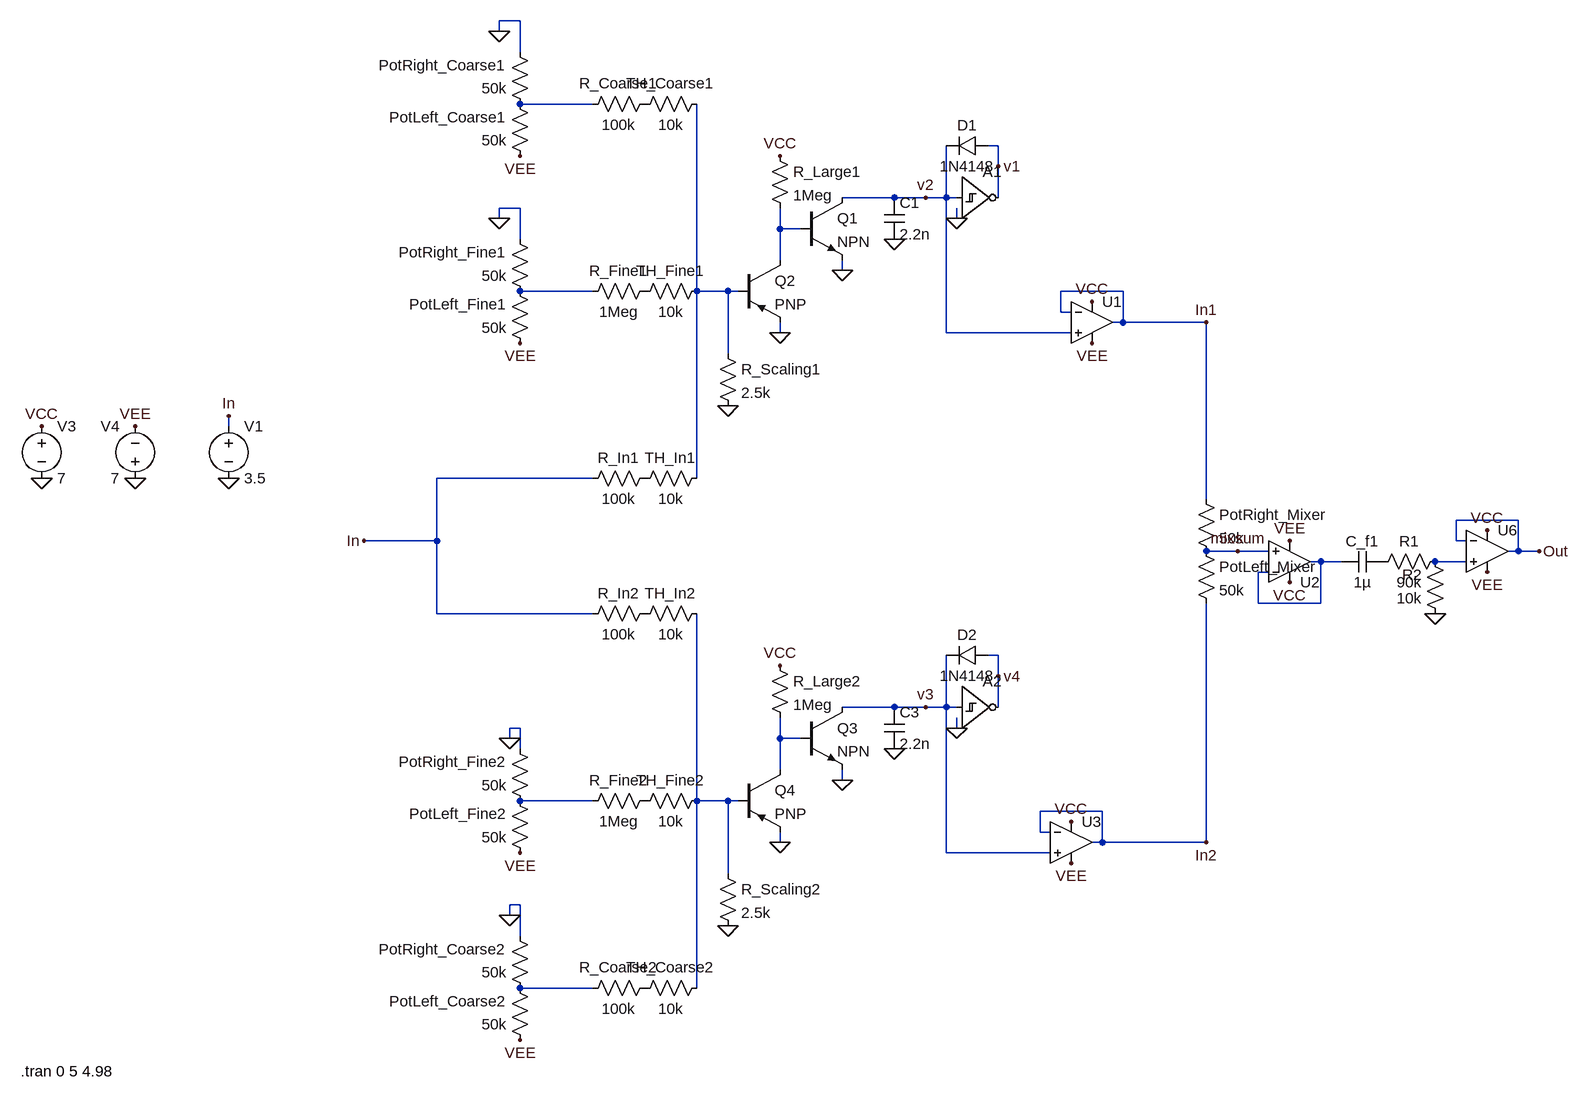
[diagram p0: schematic Oscillator.asc]
Oscillator.asc, the LTspice schematic file:
Version 4.1
SHEET 1 1464 1484
WIRE -544 -176 -576 -176
WIRE -576 -160 -576 -176
WIRE -544 -128 -544 -176
WIRE -432 -48 -544 -48
WIRE 192 16 176 16
WIRE 192 48 192 16
WIRE 32 96 -48 96
WIRE 80 96 32 96
WIRE 112 96 112 16
WIRE 112 96 80 96
WIRE 128 96 112 96
WIRE 192 96 192 48
WIRE -544 112 -576 112
WIRE -576 128 -576 112
WIRE 128 128 128 112
WIRE -144 144 -144 112
WIRE -112 144 -144 144
WIRE -544 160 -544 112
WIRE -144 192 -144 144
WIRE -48 208 -48 192
WIRE -432 240 -544 240
WIRE -272 240 -272 -48
WIRE -224 240 -272 240
WIRE -208 240 -224 240
WIRE 384 240 288 240
WIRE 288 272 288 240
WIRE 304 272 288 272
WIRE 384 288 384 240
WIRE 384 288 368 288
WIRE 512 288 384 288
WIRE -144 304 -144 288
WIRE 112 304 112 96
WIRE 304 304 112 304
WIRE -224 336 -224 240
WIRE -992 448 -992 432
WIRE -432 528 -672 528
WIRE -272 528 -272 240
WIRE 512 560 512 288
WIRE 992 592 896 592
WIRE -672 624 -672 528
WIRE -672 624 -784 624
WIRE 896 624 896 592
WIRE 912 624 896 624
WIRE 560 640 512 640
WIRE 608 640 560 640
WIRE 992 640 992 592
WIRE 992 640 976 640
WIRE 1024 640 992 640
WIRE 688 656 672 656
WIRE 720 656 688 656
WIRE 912 656 864 656
WIRE 608 672 592 672
WIRE 592 720 592 672
WIRE 688 720 688 656
WIRE 688 720 592 720
WIRE -672 736 -672 624
WIRE -432 736 -672 736
WIRE 192 800 176 800
WIRE 192 832 192 800
WIRE 32 880 -48 880
WIRE 80 880 32 880
WIRE 112 880 112 800
WIRE 112 880 80 880
WIRE 128 880 112 880
WIRE 192 880 192 832
WIRE -544 912 -560 912
WIRE 128 912 128 896
WIRE -560 928 -560 912
WIRE -144 928 -144 896
WIRE -112 928 -144 928
WIRE -544 944 -544 912
WIRE -144 976 -144 928
WIRE -48 992 -48 976
WIRE -432 1024 -544 1024
WIRE -272 1024 -272 736
WIRE -224 1024 -272 1024
WIRE -208 1024 -224 1024
WIRE 352 1040 256 1040
WIRE 256 1072 256 1040
WIRE 272 1072 256 1072
WIRE -144 1088 -144 1072
WIRE 352 1088 352 1040
WIRE 352 1088 336 1088
WIRE 512 1088 512 720
WIRE 512 1088 352 1088
WIRE 112 1104 112 880
WIRE 272 1104 112 1104
WIRE -224 1136 -224 1024
WIRE -544 1184 -560 1184
WIRE -560 1200 -560 1184
WIRE -544 1232 -544 1184
WIRE -432 1312 -544 1312
WIRE -272 1312 -272 1024
FLAG -48 208 0
FLAG 192 48 v1
FLAG 80 96 v2
FLAG 1024 640 Out
FLAG 128 128 0
FLAG 32 160 0
FLAG -144 304 0
FLAG -48 992 0
FLAG 192 832 v4
FLAG 80 880 v3
FLAG 128 912 0
FLAG 32 944 0
FLAG -144 1088 0
FLAG 512 288 In1
FLAG 512 1088 In2
FLAG 560 640 mixsum
FLAG 864 736 0
FLAG -224 1216 0
FLAG -224 416 0
FLAG -1280 528 0
FLAG -1136 528 0
FLAG -1280 448 VCC
FLAG -1136 448 VEE
FLAG -784 624 In
FLAG -544 320 VEE
FLAG -544 32 VEE
FLAG -576 -160 0
FLAG -576 128 0
FLAG -560 928 0
FLAG -560 1200 0
FLAG -544 1104 VEE
FLAG -544 1392 VEE
FLAG -144 32 VCC
FLAG -144 816 VCC
FLAG 336 256 VCC
FLAG 336 320 VEE
FLAG 304 1056 VCC
FLAG 304 1120 VEE
FLAG 944 608 VCC
FLAG 944 672 VEE
FLAG -992 528 0
FLAG -992 432 In
FLAG 640 624 VEE
FLAG 640 688 VCC
SYMBOL Digital\\schmtinv 128 32 R0
WINDOW 3 8 44 Invisible 2
SYMATTR Value Vhigh=9 Vt=4.45 Vh=.85 Trise=.1u Tfall=.1u
SYMATTR InstName A1
SYMBOL cap 16 96 R0
SYMATTR InstName C1
SYMATTR Value 2.2n
SYMBOL diode 176 0 R90
WINDOW 0 0 32 VBottom 2
WINDOW 3 32 32 VTop 2
SYMATTR InstName D1
SYMATTR Value 1N4148
SYMBOL npn -112 96 R0
SYMATTR InstName Q1
SYMBOL res -160 16 R0
SYMATTR InstName R_Large1
SYMATTR Value 1Meg
SYMBOL pnp -208 192 R0
SYMATTR InstName Q2
SYMBOL res -256 224 R90
WINDOW 0 0 56 VBottom 2
WINDOW 3 32 56 VTop 2
SYMATTR InstName TH_Fine1
SYMATTR Value 10k
SYMBOL res -256 -64 R90
WINDOW 0 0 56 VBottom 2
WINDOW 3 32 56 VTop 2
SYMATTR InstName TH_Coarse1
SYMATTR Value 10k
SYMBOL res -336 -64 R90
WINDOW 0 0 56 VBottom 2
WINDOW 3 32 56 VTop 2
SYMATTR InstName R_Coarse1
SYMATTR Value 100k
SYMBOL res -336 224 R90
WINDOW 0 0 56 VBottom 2
WINDOW 3 32 56 VTop 2
SYMATTR InstName R_Fine1
SYMATTR Value 1Meg
SYMBOL res -528 -32 R180
WINDOW 0 36 76 Left 2
WINDOW 3 36 40 Left 2
SYMATTR InstName PotRight_Coarse1
SYMATTR Value 50k
SYMBOL res -528 48 R180
WINDOW 0 36 76 Left 2
WINDOW 3 36 40 Left 2
SYMATTR InstName PotLeft_Coarse1
SYMATTR Value 50k
SYMBOL res -528 256 R180
WINDOW 0 36 76 Left 2
WINDOW 3 36 40 Left 2
SYMATTR InstName PotRight_Fine1
SYMATTR Value 50k
SYMBOL res -528 336 R180
WINDOW 0 36 76 Left 2
WINDOW 3 36 40 Left 2
SYMATTR InstName PotLeft_Fine1
SYMATTR Value 50k
SYMBOL res -256 512 R90
WINDOW 0 0 56 VBottom 2
WINDOW 3 32 56 VTop 2
SYMATTR InstName TH_In1
SYMATTR Value 10k
SYMBOL res -336 512 R90
WINDOW 0 0 56 VBottom 2
WINDOW 3 32 56 VTop 2
SYMATTR InstName R_In1
SYMATTR Value 100k
SYMBOL Digital\\schmtinv 128 816 R0
WINDOW 3 8 44 Invisible 2
SYMATTR Value Vhigh=9 Vt=4.45 Vh=.85 Trise=.1u Tfall=.1u
SYMATTR InstName A2
SYMBOL cap 16 880 R0
SYMATTR InstName C3
SYMATTR Value 2.2n
SYMBOL diode 176 784 R90
WINDOW 0 0 32 VBottom 2
WINDOW 3 32 32 VTop 2
SYMATTR InstName D2
SYMATTR Value 1N4148
SYMBOL npn -112 880 R0
SYMATTR InstName Q3
SYMBOL res -160 800 R0
SYMATTR InstName R_Large2
SYMATTR Value 1Meg
SYMBOL pnp -208 976 R0
SYMATTR InstName Q4
SYMBOL res -256 1008 R90
WINDOW 0 0 56 VBottom 2
WINDOW 3 32 56 VTop 2
SYMATTR InstName TH_Fine2
SYMATTR Value 10k
SYMBOL res -256 1296 R90
WINDOW 0 0 56 VBottom 2
WINDOW 3 32 56 VTop 2
SYMATTR InstName TH_Coarse2
SYMATTR Value 10k
SYMBOL res -336 1296 R90
WINDOW 0 0 56 VBottom 2
WINDOW 3 32 56 VTop 2
SYMATTR InstName R_Coarse2
SYMATTR Value 100k
SYMBOL res -336 1008 R90
WINDOW 0 0 56 VBottom 2
WINDOW 3 32 56 VTop 2
SYMATTR InstName R_Fine2
SYMATTR Value 1Meg
SYMBOL res -528 1328 R180
WINDOW 0 36 76 Left 2
WINDOW 3 36 40 Left 2
SYMATTR InstName PotRight_Coarse2
SYMATTR Value 50k
SYMBOL res -528 1408 R180
WINDOW 0 36 76 Left 2
WINDOW 3 36 40 Left 2
SYMATTR InstName PotLeft_Coarse2
SYMATTR Value 50k
SYMBOL res -528 1040 R180
WINDOW 0 36 76 Left 2
WINDOW 3 36 40 Left 2
SYMATTR InstName PotRight_Fine2
SYMATTR Value 50k
SYMBOL res -528 1120 R180
WINDOW 0 36 76 Left 2
WINDOW 3 36 40 Left 2
SYMATTR InstName PotLeft_Fine2
SYMATTR Value 50k
SYMBOL res -256 720 R90
WINDOW 0 0 56 VBottom 2
WINDOW 3 32 56 VTop 2
SYMATTR InstName TH_In2
SYMATTR Value 10k
SYMBOL res -336 720 R90
WINDOW 0 0 56 VBottom 2
WINDOW 3 32 56 VTop 2
SYMATTR InstName R_In2
SYMATTR Value 100k
SYMBOL res 496 544 R0
SYMATTR InstName PotRight_Mixer
SYMATTR Value 50k
SYMBOL res 496 624 R0
SYMATTR InstName PotLeft_Mixer
SYMATTR Value 50k
SYMBOL OpAmps\\UniversalOpAmp2 336 288 R0
SYMATTR InstName U1
SYMBOL OpAmps\\UniversalOpAmp2 304 1088 R0
SYMATTR InstName U3
SYMBOL cap 784 640 R90
WINDOW 0 0 32 VBottom 2
WINDOW 3 32 32 VTop 2
SYMATTR InstName C_f1
SYMATTR Value 1µ
SYMBOL res 880 752 R180
WINDOW 0 36 76 Left 2
WINDOW 3 36 40 Left 2
SYMATTR InstName R2
SYMATTR Value 10k
SYMBOL OpAmps\\UniversalOpAmp2 944 640 R0
SYMATTR InstName U6
SYMBOL res -240 1120 R0
SYMATTR InstName R_Scaling2
SYMATTR Value 2.5k
SYMBOL res -240 320 R0
SYMATTR InstName R_Scaling1
SYMATTR Value 2.5k
SYMBOL voltage -1280 432 R0
WINDOW 123 0 0 Left 0
WINDOW 39 0 0 Left 0
SYMATTR InstName V3
SYMATTR Value 7
SYMBOL voltage -1136 544 R180
WINDOW 0 24 96 Left 2
WINDOW 3 24 16 Left 2
WINDOW 123 0 0 Left 0
WINDOW 39 0 0 Left 0
SYMATTR InstName V4
SYMATTR Value 7
SYMBOL voltage -992 432 R0
WINDOW 123 0 0 Left 0
WINDOW 39 0 0 Left 0
SYMATTR InstName V1
SYMATTR Value 3.5
SYMBOL OpAmps\\UniversalOpAmp2 640 656 M180
SYMATTR InstName U2
SYMBOL res 880 640 R90
WINDOW 0 0 56 VBottom 2
WINDOW 3 32 56 VTop 2
SYMATTR InstName R1
SYMATTR Value 90k
TEXT -1312 1440 Left 2 !.tran 0 5 4.98

The netlist it stands for:
* Oscillator.asc
A1 v2 0 0 0 0 v1 0 0 SCHMITT Vhigh=9 Vt=4.45 Vh=.85 Trise=.1u Tfall=.1u
C1 v2 0 2.2n
D1 v1 v2 1N4148
Q1 v2 N002 0 0 NPN
R_Large1 VCC N002 1Meg
Q2 N002 N004 0 0 PNP
R§TH_Fine1 N004 P001 10k
R§TH_Coarse1 N004 P002 10k
R_Coarse1 P002 N001 100k
R_Fine1 P001 N003 1Meg
R§PotRight_Coarse1 N001 0 50k
R§PotLeft_Coarse1 VEE N001 50k
R§PotRight_Fine1 N003 0 50k
R§PotLeft_Fine1 VEE N003 50k
R§TH_In1 N004 P003 10k
R_In1 P003 In 100k
A2 v3 0 0 0 0 v4 0 0 SCHMITT Vhigh=9 Vt=4.45 Vh=.85 Trise=.1u Tfall=.1u
C3 v3 0 2.2n
D2 v4 v3 1N4148
Q3 v3 N007 0 0 NPN
R_Large2 VCC N007 1Meg
Q4 N007 N009 0 0 PNP
R§TH_Fine2 N009 P004 10k
R§TH_Coarse2 N009 P005 10k
R_Coarse2 P005 N010 100k
R_Fine2 P004 N008 1Meg
R§PotRight_Coarse2 N010 0 50k
R§PotLeft_Coarse2 VEE N010 50k
R§PotRight_Fine2 N008 0 50k
R§PotLeft_Fine2 VEE N008 50k
R§TH_In2 N009 P006 10k
R_In2 P006 In 100k
R§PotRight_Mixer In1 mixsum 50k
R§PotLeft_Mixer mixsum In2 50k
X§U1 v2 In1 VCC VEE In1 level2 Avol=1Meg GBW=10Meg Slew=10Meg Ilimit=25m Rail=0 Vos=0 En=0 Enk=0 In=0 Ink=0 Rin=500Meg  ; pins In+ In- V+ V- OUT
X§U3 v3 In2 VCC VEE In2 level2 Avol=1Meg GBW=10Meg Slew=10Meg Ilimit=25m Rail=0 Vos=0 En=0 Enk=0 In=0 Ink=0 Rin=500Meg  ; pins In+ In- V+ V- OUT
C_f1 P007 N005 1µ
R2 0 N006 10k
X§U6 N006 Out VCC VEE Out level2 Avol=1Meg GBW=10Meg Slew=10Meg Ilimit=25m Rail=0 Vos=0 En=0 Enk=0 In=0 Ink=0 Rin=500Meg  ; pins In+ In- V+ V- OUT
R_Scaling2 N009 0 2.5k
R_Scaling1 N004 0 2.5k
V3 VCC 0 7
V4 0 VEE 7
V1 In 0 3.5
X§U2 mixsum N005 VCC VEE N005 level2 Avol=1Meg GBW=10Meg Slew=10Meg Ilimit=25m Rail=0 Vos=0 En=0 Enk=0 In=0 Ink=0 Rin=500Meg  ; pins In+ In- V+ V- OUT
R1 N006 P007 90k
.model D D
.lib standard.dio
.model NPN NPN
.model PNP PNP
.lib standard.bjt
.tran 0 5 4.98
.lib UniversalOpAmp2.lib
.backanno
.end